# EAGLE design 23Octubre (EAGLE 9.2.0)
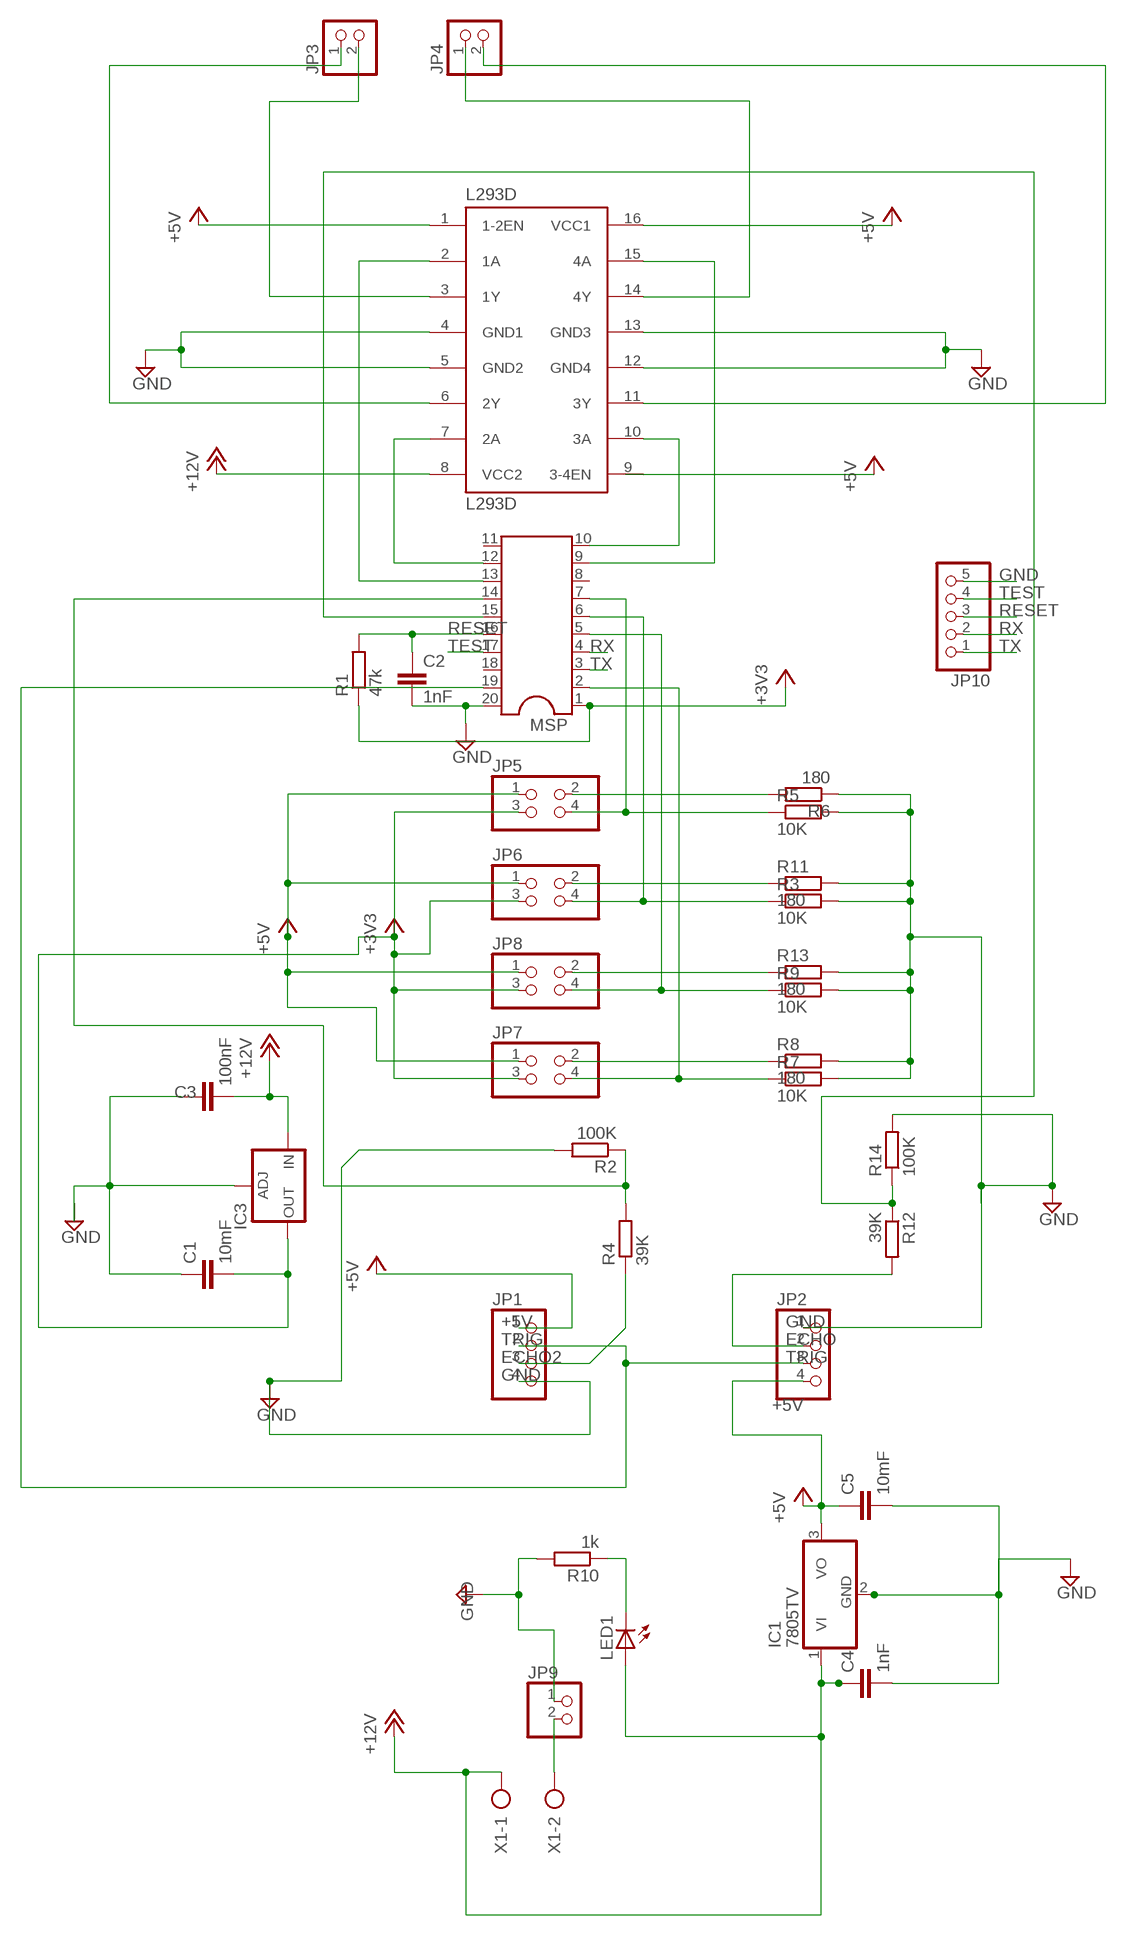
[diagram p0: schematic, sheet 1]

## Parts
C1  10mF  C-EU050-025X075  [C050-025X075]
C2  1nF  C-EU050-025X075  [C050-025X075]
C3  100nF  C-EU050-025X075  [C050-025X075]
C4  1nF  C-EU050-025X075  [C050-025X075]
C5  10mF  C-EU050-025X075  [C050-025X075]
IC1  7805TV  [TO220V]
IC3  LM317TS  [317TS]
JP1  PINHD-1X4  [1X04]
JP2  PINHD-1X4  [1X04]
JP3  PINHD-1X2  [1X02]
JP4  PINHD-1X2  [1X02]
JP5  PINHD-2X2  [2X02]
JP6  PINHD-2X2  [2X02]
JP7  PINHD-2X2  [2X02]
JP8  PINHD-2X2  [2X02]
JP9  PINHD-1X2  [1X02]
JP10  PINHD-1X5  [1X05]
L293D  L293D  [DIL16]
LED1  LED5MM  [LED5MM]
MSP  DIL20  [DIL20]
R1  47k  R-EU_0207/10  [0207/10]
R2  100K  R-EU_0207/10  [0207/10]
R3  10K  R-EU_0207/10  [0207/10]
R4  39K  R-EU_0207/10  [0207/10]
R5  10K  R-EU_0207/10  [0207/10]
R6  180  R-EU_0207/10  [0207/10]
R7  10K  R-EU_0207/10  [0207/10]
R8  180  R-EU_0207/10  [0207/10]
R9  10K  R-EU_0207/10  [0207/10]
R10  1k  R-EU_0207/10  [0207/10]
R11  180  R-EU_0207/10  [0207/10]
R12  39K  R-EU_0207/10  [0207/10]
R13  180  R-EU_0207/10  [0207/10]
R14  100K  R-EU_0207/10  [0207/10]
X1  AK300/2  [AK300/2]

## Nets
+3V3: C1.2 IC3.2(OUT) JP5.3 JP6.3 JP7.3 JP8.3 MSP.1 R1.1
+5V: C5.1 IC1.3(VO) JP1.1 JP2.4 JP5.1 JP6.1 JP7.1 JP8.1 L293D.1(1-2EN) L293D.9(3-4EN) L293D.16(VCC1)
+12V: C3.2 C4.1 IC1.1(VI) IC3.3(IN) L293D.8(VCC2) LED1.A X1.1
ECHO: JP2.2 R12.2
ECHO2: JP1.3 R4.1
GND: C1.1 C2.2 C3.1 C4.2 C5.2 IC1.2(GND) IC3.1(ADJ) JP1.4 JP2.1 JP9.1 JP10.5 L293D.4(GND1) L293D.5(GND2) L293D.12(GND4) L293D.13(GND3) MSP.20 R2.2 R3.2 R5.2 R6.1 R7.2 R8.2 R9.2 R10.2 R11.2 R13.2 R14.2
N$1: L293D.7(2A) MSP.12
N$2: L293D.10(3A) MSP.10
N$3: L293D.15(4A) MSP.9
N$4: L293D.2(1A) MSP.13
N$5: JP5.4 MSP.7 R5.1
N$6: JP6.4 MSP.6 R3.1
N$7: JP8.4 MSP.5 R9.1
N$8: JP7.4 MSP.2 R7.1
N$11: JP3.1 L293D.6(2Y)
N$12: JP5.2 R6.2
N$13: JP6.2 R11.1
N$14: JP8.2 R13.1
N$15: JP7.2 R8.1
N$16: JP3.2 L293D.3(1Y)
N$17: MSP.15 R12.1 R14.1
N$18: LED1.K(C) R10.1
N$19: JP4.2 L293D.11(3Y)
N$22: JP4.1 L293D.14(4Y)
N$26: JP9.2 X1.2
N$29: MSP.14 R2.1 R4.2
RESET: C2.1 JP10.3 MSP.16 R1.2
RX: JP10.2 MSP.4
TEST: JP10.4 MSP.17
TRIG: JP1.2 JP2.3 MSP.19
TX: JP10.1 MSP.3
Unconnected: MSP.8 MSP.11 MSP.18

## Library data of the parts
C1-C5 = rcl:C-EU: CAPACITOR, European symbol; SPICEPREFIX: C
IC1 = linear:78*: Positive VOLTAGE REGULATOR Source: http://cache.national.com/ds/LM/LM78L05.pdf http://www.fairchildsemi.com/ds/LM/LM7805.pdf
IC3 = v-reg:LM317TS: VOLTAGE REGULATOR
JP1 JP2 = pinhead:PINHD-1X4: PIN HEADER
JP3 JP4 JP9 = pinhead:PINHD-1X2: PIN HEADER
JP5-JP8 = pinhead:PINHD-2X2: PIN HEADER
JP10 = pinhead:PINHD-1X5: PIN HEADER
L293D = st-microelectronics:L293D: PUSH-PULL 4 CHANNEL DRIVER; MPN: L293D; OC_FARNELL: 9589619; OC_NEWARK: 56P8249
LED1 = led:LED: LED OSRAM: - CHIPLED LG R971, LG N971, LY N971, LG Q971, LY Q971, LO R971, LY R971 LH N974, LH R974 LS Q976, LO Q976, LY Q976 LO Q996 - Hyper CHIPLED LW Q18S LB Q993, LB Q99A, LB R99A - SideLED LS A670, LO A670, LY A670, LG A670, LP A670 LB A673, LV A673, LT A673, LW A673 LH A674 LY A675 LS A676, LA A676, LO A676, LY A676, LW A676 LS A679, LY A679, LG A679 - Hyper Micro SIDELED® LS Y876, LA Y876, LO Y876, LY Y876 LT Y87S - SmartLED LW L88C, LW L88S LB L89C, LB L89S, LG L890 LS L89K, LO L89K, LY L89K LS L896, LA L896, LO L896, LY L896 - TOPLED LS T670, LO T670, LY T670, LG T670, LP T670 LSG T670, LSP T670, LSY T670, LOP T670, LYG T670 LG T671, LOG T671, LSG T671 LB T673, LV T673, LT T673, LW T673 LH T674 LS T676, LA T676, LO T676, LY T676, LB T676, LH T676, LSB T676, LW T676 LB T67C, LV T67C, LT T67C, LS T67K, LO T67K, LY T67K, LW E67C LS E67B, LA E67B, LO E67B, LY E67B, LB E67C, LV E67C, LT E67C LW T67C LS T679, LY T679, LG T679 LS T770, LO T770, LY T770, LG T770, LP T770 LB T773, LV T773, LT T773, LW T773 LH T774 LS E675, LA E675, LY E675, LS T675 LS T776, LA T776, LO T776, LY T776, LB T776 LHGB T686 LT T68C, LB T68C - Hyper Mini TOPLED® LB M676 - Mini TOPLED Santana® LG M470 LS M47K, LO M47K, LY M47K Source: http://www.osram.convergy.de LUXEON: - LUMILED® LXK2-PW12-R00, LXK2-PW12-S00, LXK2-PW14-U00, LXK2-PW14-V00 LXK2-PM12-R00, LXK2-PM12-S00, LXK2-PM14-U00 LXK2-PE12-Q00, LXK2-PE12-R00, LXK2-PE12-S00, LXK2-PE14-T00, LXK2-PE14-U00 LXK2-PB12-K00, LXK2-PB12-L00, LXK2-PB12-M00, LXK2-PB14-N00, LXK2-PB14-P00, LXK2-PB14-Q00 LXK2-PR12-L00, LXK2-PR12-M00, LXK2-PR14-Q00, LXK2-PR14-R00 LXK2-PD12-Q00, LXK2-PD12-R00, LXK2-PD12-S00 LXK2-PH12-R00, LXK2-PH12-S00 LXK2-PL12-P00, LXK2-PL12-Q00, LXK2-PL12-R00 Source: www.luxeon.com KINGBRIGHT: KA-3528ASYC Source: www.kingbright.com
MSP = ic-package:DIL20: Dual In Line / Socket
R1-R14 = rcl:R-EU_: RESISTOR, European symbol; SPICEPREFIX: R
X1 = con-ptr500:AK300/2: CONNECTOR; OC_FARNELL: unknown; OC_NEWARK: unknown

## Board
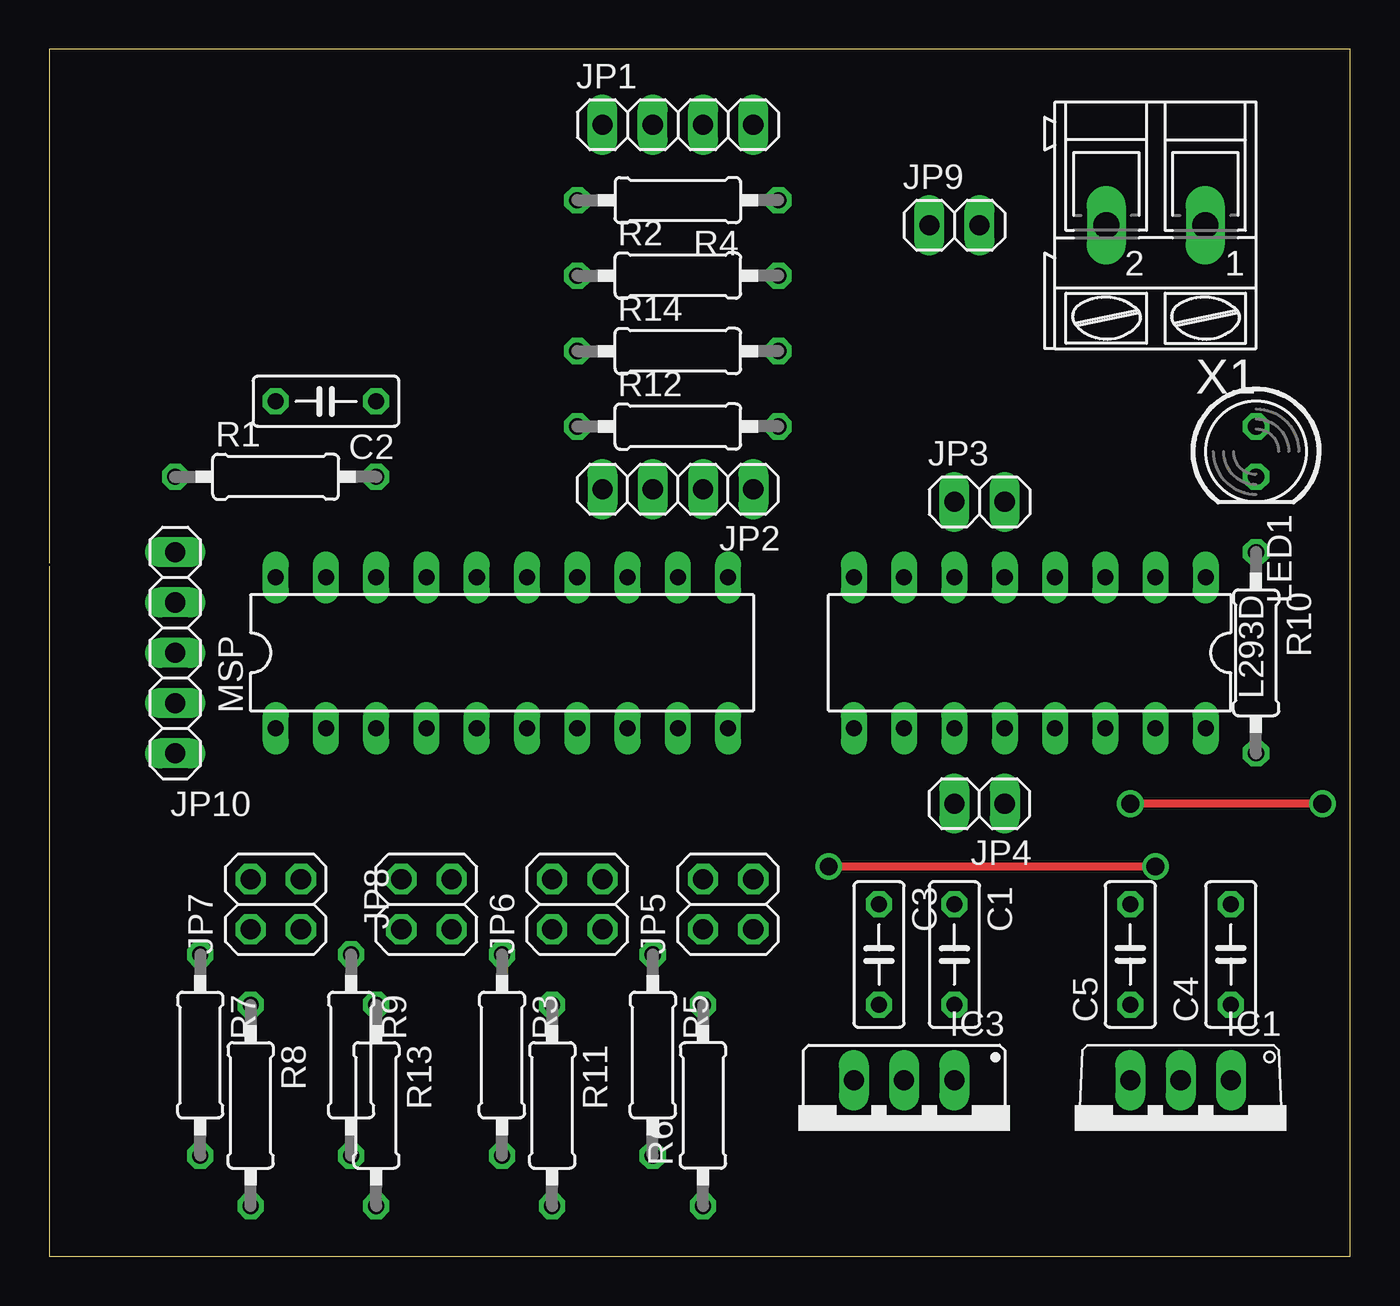
[diagram p1: board, top side]
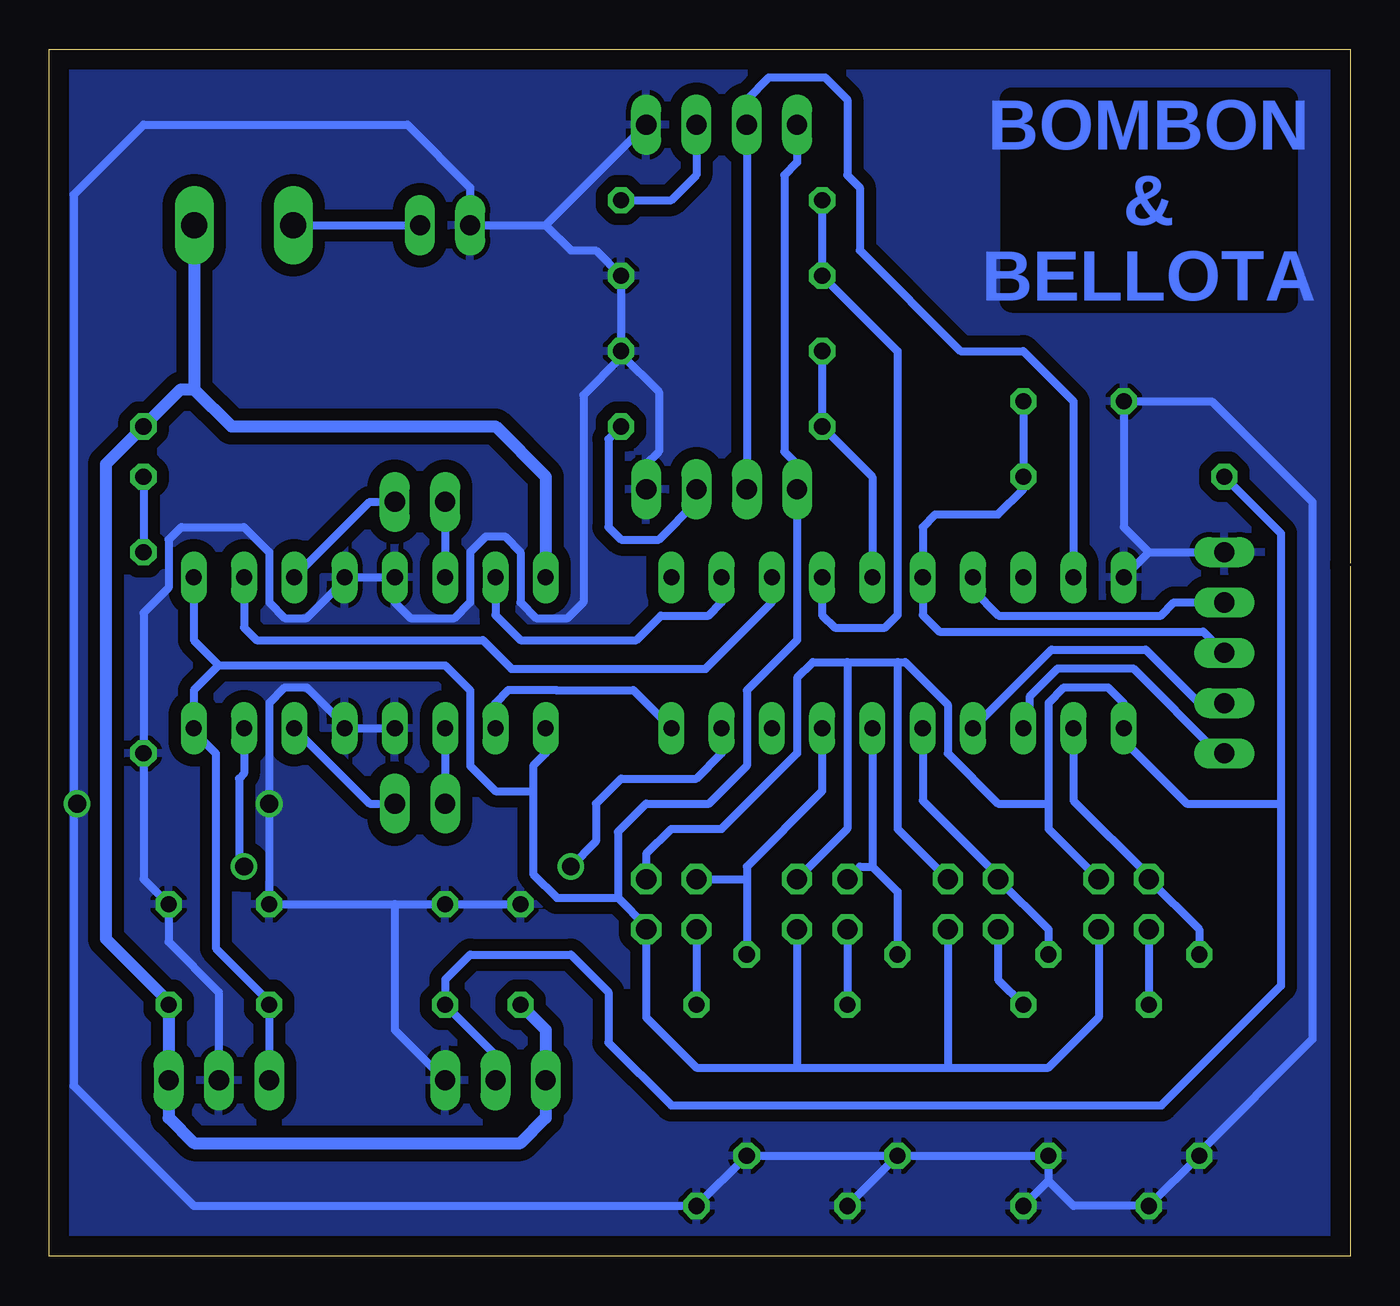
[diagram p2: board, bottom side, seen from below]

Size 65.71 x 60.95 mm. Coordinates in mm from the lower left corner, seen from the top.
Outline: 0,35 0,60.95 65.71,60.95 65.71,0 0,0 0,34.85
Copper layers (1*16): Top 0.035mm / dielectric 1.5mm / Bottom 0.035mm
Design rules "default *": minimum track width 16mil, minimum drill 0.35mm, track to track 16mil, track to pad 16mil, pad to pad 16mil, via to via 16mil, smd to smd 6mil, copper to edge 40mil, drill to drill 6mil, minimum pad ring 10mil, minimum via ring 8mil, stop-mask expansion 4mil, vias tented up to drill 0mil, thermal gap 10mil

### Footprints (pad centres in the part's own frame; a part is rotated, then mirrored left to right if it is on the bottom)
C050-025X075 = drill 0.813 octagon: 1 -2.54,0; 2 2.54,0
TO220V = drill 1.016 long: 1 -2.54,-2.54; 2 0,-2.54; 3 2.54,-2.54
317TS = drill 1.016 long: 1 -2.54,-2.54; 2 0,-2.54; 3 2.54,-2.54
1X04 = drill 1.016 long: 1 -3.81,0; 2 -1.27,0; 3 1.27,0; 4 3.81,0
1X02 = drill 1.016 long: 1 -1.27,0; 2 1.27,0
2X02 = drill 1.016 octagon: 1 -1.27,-1.27; 2 -1.27,1.27; 3 1.27,-1.27; 4 1.27,1.27
1X05 = drill 1.016 long: 1 -5.08,0; 2 -2.54,0; 3 0,0; 4 2.54,0; 5 5.08,0
DIL16 = drill 0.813 long: 1 -8.89,-3.81; 2 -6.35,-3.81; 3 -3.81,-3.81; 4 -1.27,-3.81; 5 1.27,-3.81; 6 3.81,-3.81; 7 6.35,-3.81; 8 8.89,-3.81; 9 8.89,3.81; 10 6.35,3.81; 11 3.81,3.81; 12 1.27,3.81; 13 -1.27,3.81; 14 -3.81,3.81; 15 -6.35,3.81; 16 -8.89,3.81
LED5MM = drill 0.813 octagon: A -1.27,0; K 1.27,0
DIL20 = drill 0.813 long: 1 -11.43,-3.81; 2 -8.89,-3.81; 3 -6.35,-3.81; 4 -3.81,-3.81; 5 -1.27,-3.81; 6 1.27,-3.81; 7 3.81,-3.81; 8 6.35,-3.81; 9 8.89,-3.81; 10 11.43,-3.81; 11 11.43,3.81; 12 8.89,3.81; 13 6.35,3.81; 14 3.81,3.81; 15 1.27,3.81; 16 -1.27,3.81; 17 -3.81,3.81; 18 -6.35,3.81; 19 -8.89,3.81; 20 -11.43,3.81
0207/10 = drill 0.813 octagon: 1 -5.08,0; 2 5.08,0
AK300/2 = drill 1.321 long: 1 -2.515,0; 2 2.489,0

### Placement (x,y rotation side)
C1  45.72,15.24 270 top
C2  13.97,43.18 180 top
C3  41.91,15.24 270 top
C4  59.69,15.24 90 top
C5  54.61,15.24 90 top
IC1  57.15,6.35 180 top
IC3  43.18,6.35 180 top
JP1  31.75,57.15 0 top
JP2  31.75,38.73 180 top
JP3  46.99,38.1 0 top
JP4  46.99,22.86 180 top
JP5  34.29,17.78 90 top
JP6  26.67,17.78 90 top
JP7  11.43,17.78 90 top
JP8  19.05,17.78 90 top
JP9  45.72,52.07 0 top
JP10  6.35,30.48 90 top
L293D  49.53,30.48 180 top
LED1  60.96,40.64 270 top
MSP  22.86,30.48 0 top
R1  11.43,39.37 0 top
R2  31.75,49.53 0 top
R3  22.86,10.16 270 top
R4  31.75,53.34 180 top
R5  30.48,10.16 270 top
R6  33.02,7.62 90 top
R7  7.62,10.16 270 top
R8  10.16,7.62 270 top
R9  15.24,10.16 270 top
R10  60.96,30.48 270 top
R11  25.4,7.62 270 top
R12  31.75,41.91 0 top
R13  16.51,7.62 270 top
R14  31.75,45.72 0 top
X1  55.88,52.07 180 top

### Tracks (layer width: path | path; a pad name or v marks a point on that pad's centre or on a via)
+3V3
  Bottom 0.406: R1.1 3.49,36.51 3.49,22.86 | JP7.3 15.24,21.59 15.24,22.86 | JP8.3 22.86,21.59 22.86,30 | JP6.3 25.4,21.59 25.4,30 | IC3.2 43.18,10.16 C1.2 45.72,13.97 44.45,15.24 39.37,15.24 37.47,13.34 37.47,10.79 34.29,7.62 9.53,7.62 3.49,13.65 3.49,22.86 | JP5.3 35.56,20.32 34.29,21.59 31.75,21.59 27.94,25.4 27.94,29.21 27.15,30 25.4,30 | 25.4,30 22.86,30 | 22.86,30 22.47,30 20.32,27.86 20.32,25.4 17.78,22.86 15.24,22.86 | 3.49,22.86 8.26,22.86 11.43,26.04 MSP.1 11.43,27.94 12.22,28.73 14.45,28.73 15.24,27.94 15.24,22.86
+5V
  Bottom 0.406: IC1.3 C5.1 54.61,12.86 57.31,15.56 57.31,25.4 58.42,26.51 L293D.16 58.42,28.57 57.15,29.84 | 36.99,18.1 35.56,16.67 JP5.1 35.56,12.07 33.02,9.53 27.94,9.53 | 36.99,18.1 36.99,21.43 35.56,22.86 32.39,22.86 30.48,24.77 30.48,28.57 27.94,31.11 JP2.4 27.94,40.01 28.57,40.64 28.57,54.61 27.94,55.25 JP1.1 | L293D.9 40.64,25.4 41.28,24.77 41.28,23.49 | 41.28,23.49 41.28,19.3 40.07,18.1 36.99,18.1 | 57.15,29.84 58.42,31.11 L293D.1 | 57.15,29.84 45.72,29.84 44.45,28.57 44.45,24.77 43.18,23.49 41.28,23.49 | 27.94,9.53 20.32,9.53 | JP8.1 20.32,9.53 | JP6.1 27.94,9.53 | JP7.1 12.7,12.07 15.24,9.53 20.32,9.53
+12V
  Bottom 0.406: 58.42,52.07 X1.1 | 59.69,12.86 C4.1
  Bottom 0.61: C4.1 IC1.1 59.69,6.98 58.42,5.71 41.91,5.71 40.64,6.98 IC3.3 40.64,11.43 C3.2 | 59.69,12.86 62.87,16.03 62.87,40.01 LED1.A 59.08,43.79 58.4,43.79 | X1.1 58.4,43.79 | 58.4,43.79 56.52,41.91 43.18,41.91 40.64,39.37 L293D.8
ECHO
  Bottom 0.406: JP2.2 33.02,38.1 34.93,36.2 36.83,36.2 37.47,36.83 37.47,41.28 R12.2
ECHO2
  Bottom 0.406: JP1.3 33.02,54.61 34.29,53.34 R4.1
GND  (via drill 0.9)
  Top 0.406: v64.32,22.86 v54.61,22.86
  Bottom 0.406: R11.2 R3.2 | R13.2 15.24,3.81 | 15.24,3.81 R9.2 R3.2 | R3.2 R5.2 R6.1 58.42,2.54 64.49,8.61 64.49,22.86 | L293D.12 L293D.13 50.8,26.83 52.71,28.73 53.82,28.73 54.61,27.94 v54.61,22.86 C5.2 48.26,17.78 | C3.1 C1.1 48.26,17.78 | R2.2 R14.2 | R14.2 36.83,45.56 34.93,43.66 34.93,40.64 35.56,40.01 JP2.1 | 36.83,49.69 R2.2 | L293D.5 L293D.4 50.8,34.13 52.71,32.23 53.82,32.23 54.61,33.02 54.61,35.56 55.88,36.83 59.05,36.83 59.69,36.2 59.69,33.76 60.96,32.49 R10.2 | R10.2 60.96,19.05 C4.2 59.69,15.88 57.15,13.34 IC1.2 | 60.96,25.56 R10.2 | R14.2 36.83,45.4 38.73,43.5 38.73,33.02 39.53,32.23 41.12,32.23 41.91,33.02 41.91,35.56 42.7,36.35 43.66,36.35 44.45,35.56 44.45,33.02 45.24,32.23 47.47,32.23 48.26,33.02 L293D.5 | L293D.5 48.1,34.29 | 40.64,52.07 JP1.4 | 40.64,52.07 JP9.1 44.45,53.98 47.62,57.15 60.96,57.15 64.49,53.62 64.49,22.86 | IC3.1 48.26,11.43 48.26,17.78 | 64.49,22.86 v64.32,22.86 64.13,22.86 | 10.16,35.56 11.43,36.83 C2.2 6.98,43.18 1.9,38.1 1.9,10.95 7.62,5.24 R7.2 R8.2 13.97,2.54 15.24,3.81 | 10.16,35.56 JP10.5 | MSP.20 10.16,35.56 | R2.2 38.1,50.8 39.37,50.8 40.64,52.07
  pour Bottom (isolate 0.61): 0,60.96 66.04,60.96 66.04,0 0,0
N$1
  Bottom 0.406: MSP.12 31.75,33.02 32.41,32.36 34.82,32.36 36.06,31.11 41.91,31.11 43.18,32.39 L293D.7 43.18,33.14
N$2
  Bottom 0.406: MSP.10 36.22,28.6 36.25,28.57 40.09,28.57 40.11,28.6 42.52,28.6 43.18,27.94 L293D.10
N$3  (via drill 0.9)
  Top 0.406: v55.88,19.68 v39.37,19.68
  Bottom 0.406: MSP.9 31.75,25.4 33.02,24.13 36.83,24.13 38.1,22.86 38.1,20.95 v39.37,19.68 | L293D.15 55.88,24.38 56.13,24.13 56.13,19.94 v55.88,19.68
N$4
  Bottom 0.406: MSP.13 29.21,33.02 32.56,29.67 42.37,29.67 43.82,31.11 55.25,31.11 55.88,31.75 L293D.2
N$5
  Bottom 0.406: 30.48,19.05 R5.1 | 30.48,19.05 30.48,19.68 26.67,23.49 MSP.7 | JP5.4 30.48,19.05
N$6
  Bottom 0.406: MSP.6 24.13,19.68 | 24.13,19.68 22.86,18.41 R3.1 | JP6.4 24.76,19.68 24.13,19.68
N$7
  Bottom 0.406: MSP.5 21.59,23.02 17.78,19.21 JP8.4 15.24,16.51 R9.1
N$8
  Bottom 0.406: R7.1 7.62,16.51 JP7.4 10.16,19.21 13.97,23.02 MSP.2
N$11
  Bottom 0.406: JP3.1 L293D.6
N$12
  Bottom 0.406: JP5.2 R6.2
N$13
  Bottom 0.406: JP6.2 R11.1
N$14
  Bottom 0.406: R13.1 17.78,13.97 JP8.2
N$15
  Bottom 0.406: JP7.2 R8.1
N$16
  Bottom 0.406: L293D.3 49.53,38.1 JP3.2
N$17
  Bottom 0.406: R12.1 26.51,41.75 | R14.1 R12.1 | MSP.15 24.13,39.37 R12.1
N$18
  Bottom 0.406: LED1.K R10.1
N$19
  Bottom 0.406: L293D.11 JP4.2
N$22
  Bottom 0.406: L293D.14 49.53,22.86 JP4.1
N$26
  Bottom 0.406: X1.2 JP9.2
N$29
  Bottom 0.406: R4.2 R2.1 22.86,45.72 22.86,32.39 23.49,31.75 26.04,31.75 26.67,32.39 MSP.14
RESET
  Bottom 0.406: C2.1 R1.2 | 16.67,39.21 16.67,39.37 R1.2 | JP10.3 7.42,31.55 20.75,31.55 21.59,32.39 MSP.16 21.59,36.83 20.95,37.47 17.78,37.47 16.51,38.73 R1.2
RX
  Bottom 0.406: MSP.4 15.08,30.64 10.32,30.64 7.62,27.94 JP10.2
TEST
  Bottom 0.406: MSP.17 19.05,33.66 17.75,32.36 9.55,32.36 8.89,33.02 JP10.4
TRIG
  Bottom 0.406: MSP.19 13.97,43.18 16.51,45.72 19.68,45.72 24.76,50.8 24.76,53.98 25.4,54.61 25.4,58.42 26.52,59.54 29.36,59.54 30.48,58.42 JP1.2 JP2.3
TX
  Bottom 0.406: MSP.3 16.19,26.99 16.19,28.26 14.76,29.69 10.95,29.69 6.67,25.4 JP10.1

### Text on the board
Bottom: BOMBON / & / BELLOTA